# EAGLE design rc2014_z80plus (EAGLE 8.1.0)
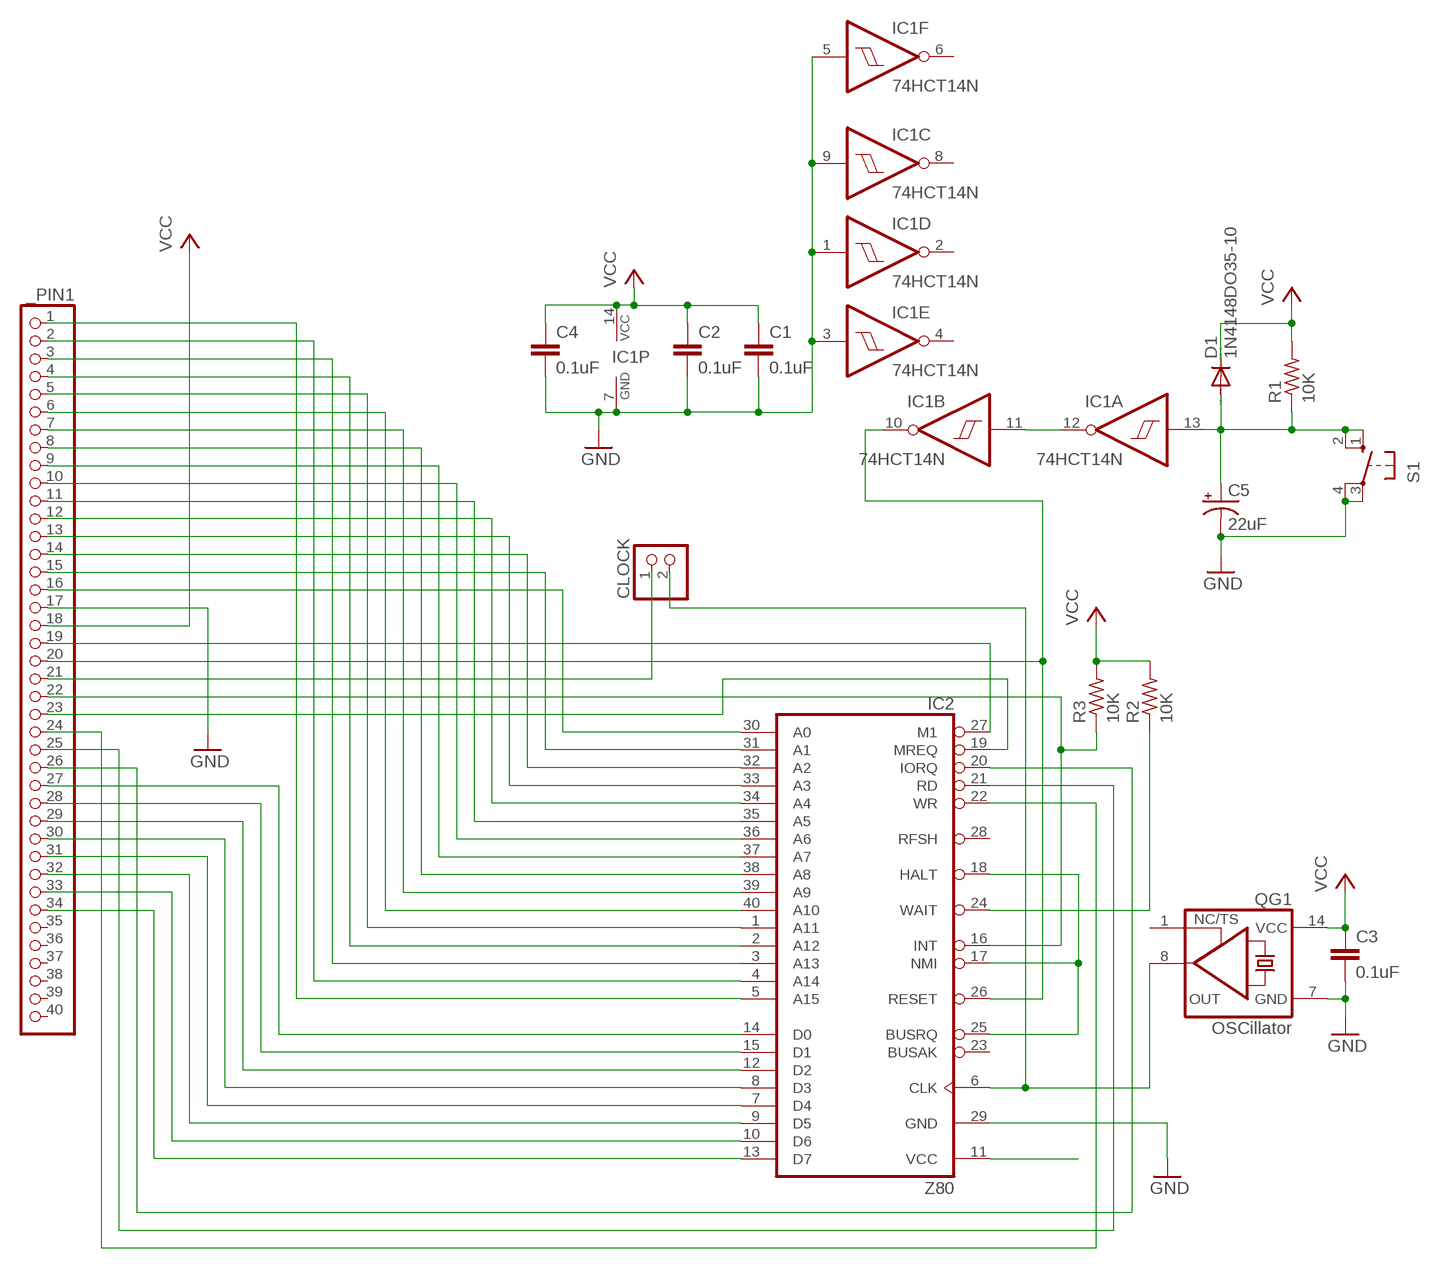
[diagram p0: schematic, sheet 1]

## Parts
_PIN1  PINHD-1X40  [1X40]
C1  0.1uF  C-EU050-024X044  [C050-024X044]
C2  0.1uF  C-EU050-024X044  [C050-024X044]
C3  0.1uF  C-EU050-024X044  [C050-024X044]
C4  0.1uF  C-EU050-024X044  [C050-024X044]
C5  22uF  CPOL-USTAP5-80  [TAP5-80]
CLOCK  PINHD-1X2  [1X02]
D1  1N4148DO35-10  [DO35-10]
IC1  74HCT14N  [DIL14]
IC2  Z80  Z80CPU  [DIL40]
QG1  OSCillator  XO-14  [DIL14S]
R1  10K  R-US_0207/10  [0207/10]
R2  10K  R-US_0207/10  [0207/10]
R3  10K  R-US_0207/10  [0207/10]
S1  10-XX  [B3F-10XX]

## Nets
/INT: _PIN1.22 IC2.16(INT) R3.1
/IORQ: _PIN1.26 IC2.20(IORQ)
/M1: _PIN1.19 IC2.27(M1)
/MREQ: _PIN1.23 IC2.19(MREQ)
/RD: _PIN1.25 IC2.21(RD)
/RST: _PIN1.20 IC1.10(B:O) IC2.26(RESET)
/WAIT: IC2.24(WAIT) R2.1
/WR: _PIN1.24 IC2.22(WR)
A0: _PIN1.16 IC2.30(A0)
A1: _PIN1.15 IC2.31(A1)
A2: _PIN1.14 IC2.32(A2)
A3: _PIN1.13 IC2.33(A3)
A4: _PIN1.12 IC2.34(A4)
A5: _PIN1.11 IC2.35(A5)
A6: _PIN1.10 IC2.36(A6)
A7: _PIN1.9 IC2.37(A7)
A8: _PIN1.8 IC2.38(A8)
A9: _PIN1.7 IC2.39(A9)
A10: _PIN1.6 IC2.40(A10)
A11: _PIN1.5 IC2.1(A11)
A12: _PIN1.4 IC2.2(A12)
A13: _PIN1.3 IC2.3(A13)
A14: _PIN1.2 IC2.4(A14)
A15: _PIN1.1 IC2.5(A15)
CLK: _PIN1.21 CLOCK.1
D0: _PIN1.27 IC2.14(D0)
D1: _PIN1.28 IC2.15(D1)
D2: _PIN1.29 IC2.12(D2)
D3: _PIN1.30 IC2.8(D3)
D4: _PIN1.31 IC2.7(D4)
D5: _PIN1.32 IC2.9(D5)
D6: _PIN1.33 IC2.10(D6)
D7: _PIN1.34 IC2.13(D7)
GND: _PIN1.17 C1.2 C2.2 C3.2 C4.2 C5.- IC1.1(D:I) IC1.3(E:I) IC1.5(F:I) IC1.7(P:GND) IC1.9(C:I) IC2.29(GND) QG1.7(GND) S1.3(P) S1.4(P1)
N$15: IC1.11(B:I) IC1.12(A:O)
OSC: CLOCK.2 IC2.6(CLK) QG1.8(OUT)
RESET: C5.+ D1.A IC1.13(A:I) R1.1 S1.1(S) S1.2(S1)
VCC: _PIN1.18 C1.1 C2.1 C3.1 C4.1 D1.C IC1.14(P:VCC) IC2.11(VCC) IC2.17(NMI) IC2.18(HALT) IC2.25(BUSRQ) QG1.14(VCC) R1.2 R2.2 R3.2
Unconnected: _PIN1.35 _PIN1.36 _PIN1.37 _PIN1.38 _PIN1.39 _PIN1.40 IC1.2(D:O) IC1.4(E:O) IC1.6(F:O) IC1.8(C:O) IC2.23(BUSAK) IC2.28(RFSH) QG1.1(TS)

## Library data of the parts
_PIN1 = pinhead:PINHD-1X40: PIN HEADER
C1-C4 = rcl:C-EU: CAPACITOR, European symbol
C5 = rcl:CPOL-US: POLARIZED CAPACITOR, American symbol
CLOCK = pinhead:PINHD-1X2: PIN HEADER
D1 = diode:1N4148: DIODE high speed (Philips)
IC1 = 74xx-eu:74*14: Hex schmitt trigger INVERTER
IC2 = zilog:Z80CPU: Z80 FAMILY DEVICE
QG1 = crystal:XO-: CRYSTAL; OC_FARNELL: unknown; OC_NEWARK: unknown
R1-R3 = rcl:R-US_: RESISTOR, American symbol
S1 = switch-omron:10-XX: OMRON SWITCH; MPN: B3F-1000; OC_FARNELL: 176432; OC_NEWARK: 36M3542

## Net classes
0 +5V: width 0.508 mm

## Board
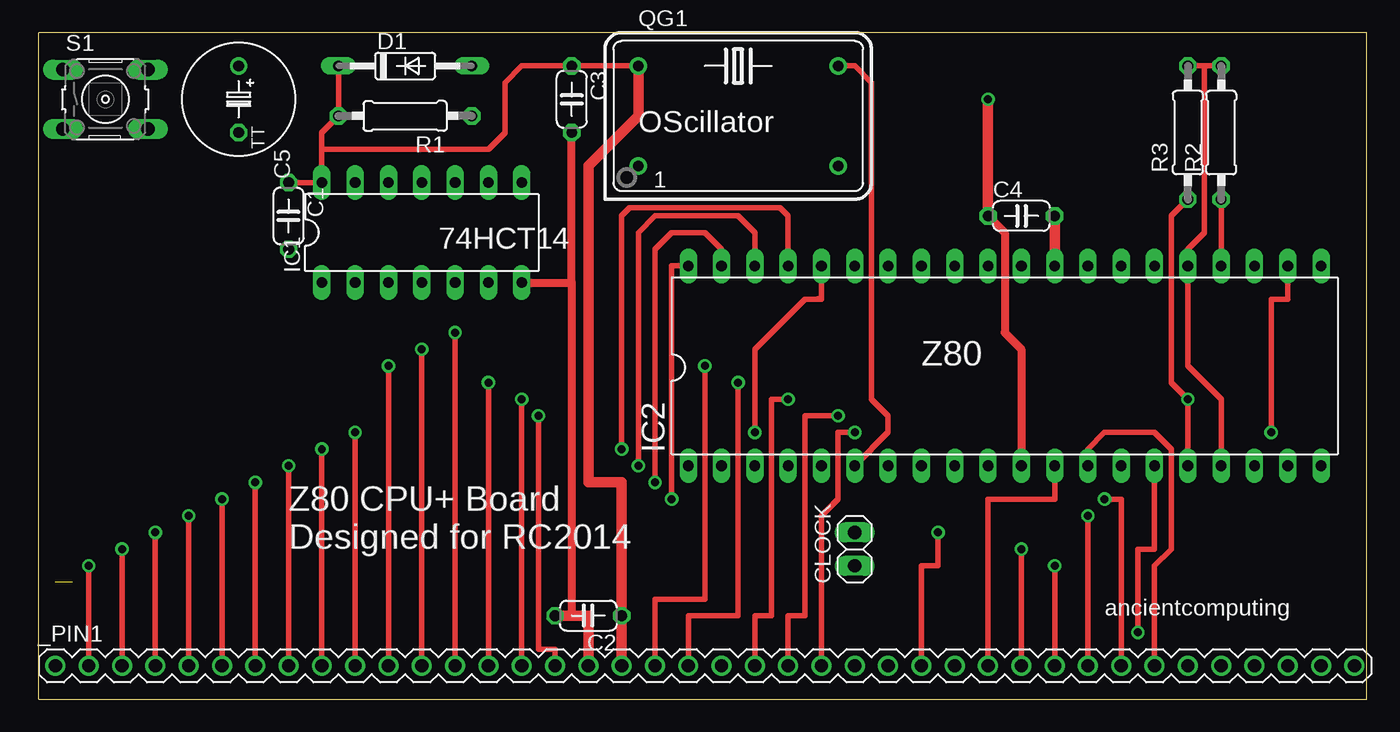
[diagram p1: board, top side]
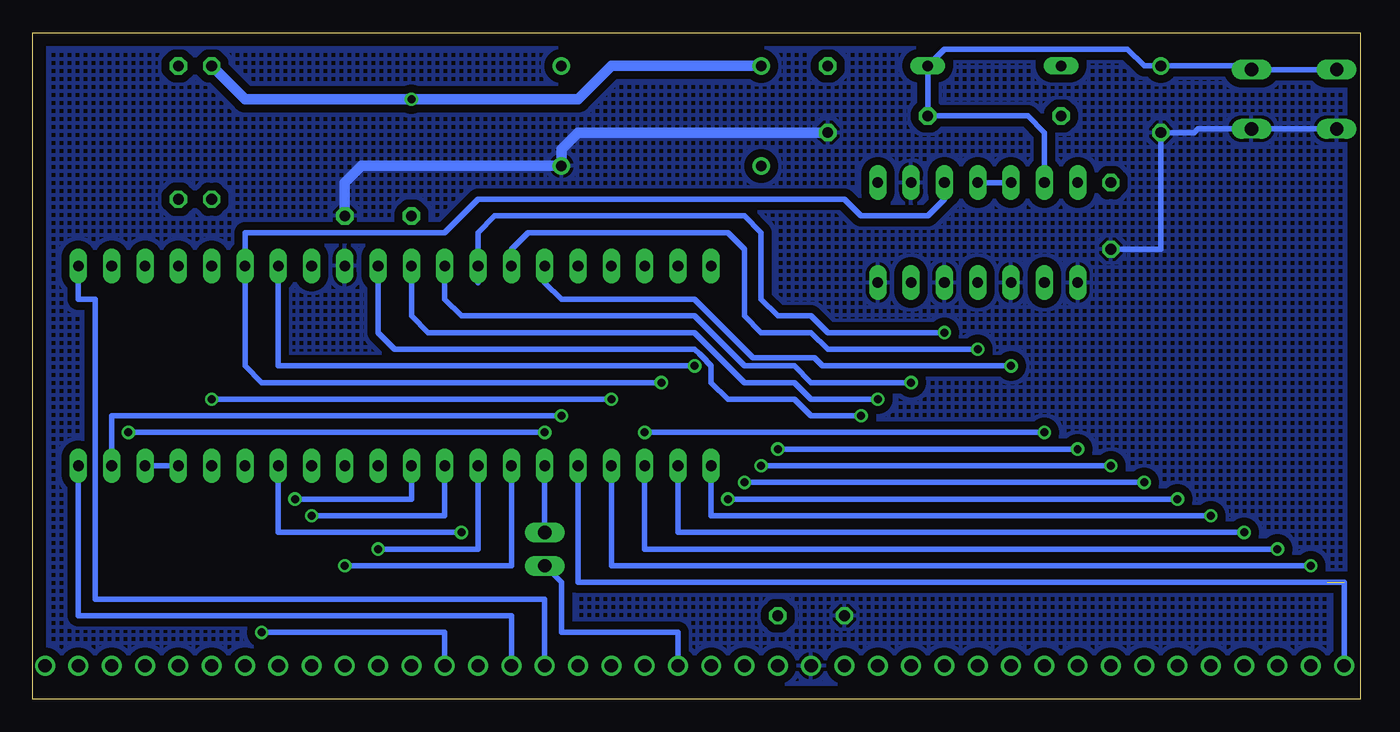
[diagram p2: board, bottom side, seen from below]

Size 101.27 x 50.79 mm. Coordinates in mm from the lower left corner, seen from the top.
Outline: 0,0 101.27,0 101.27,50.79 0,50.79 0,0
Copper layers (1*16): Top 0.035mm / dielectric 1.5mm / Bottom 0.035mm
Design rules "default *": minimum track width 20mil, minimum drill 24mil, track to track 8mil, track to pad 8mil, pad to pad 8mil, via to via 8mil, smd to smd 8mil, copper to edge 40mil, drill to drill 8mil, minimum pad ring 10mil, minimum via ring 8mil, stop-mask expansion 4mil, vias tented up to drill 0mil, thermal gap 10mil

### Footprints (pad centres in the part's own frame; a part is rotated, then mirrored left to right if it is on the bottom)
1X40 = drill 1.016: 1 -49.53,0; 2 -46.99,0; 3 -44.45,0; 4 -41.91,0; 5 -39.37,0; 6 -36.83,0; 7 -34.29,0; 8 -31.75,0; 9 -29.21,0; 10 -26.67,0; 11 -24.13,0; 12 -21.59,0; 13 -19.05,0; 14 -16.51,0; 15 -13.97,0; 16 -11.43,0; 17 -8.89,0; 18 -6.35,0; 19 -3.81,0; 20 -1.27,0; 21 1.27,0; 22 3.81,0; 23 6.35,0; 24 8.89,0; 25 11.43,0; 26 13.97,0; 27 16.51,0; 28 19.05,0; 29 21.59,0; 30 24.13,0; 31 26.67,0; 32 29.21,0; 33 31.75,0; 34 34.29,0; 35 36.83,0; 36 39.37,0; 37 41.91,0; 38 44.45,0; 39 46.99,0; 40 49.53,0
C050-024X044 = drill 0.813 octagon: 1 -2.54,0; 2 2.54,0
TAP5-80 = drill 0.813: + -2.54,0 | drill 0.813 octagon: - 2.54,0
1X02 = drill 1.016 long: 1 -1.27,0; 2 1.27,0
DO35-10 = drill 0.813 long: A 5.08,0; C -5.08,0
DIL14 = drill 0.813 long: 1 -7.62,-3.81; 2 -5.08,-3.81; 3 -2.54,-3.81; 4 0,-3.81; 5 2.54,-3.81; 6 5.08,-3.81; 7 7.62,-3.81; 8 7.62,3.81; 9 5.08,3.81; 10 2.54,3.81; 11 0,3.81; 12 -2.54,3.81; 13 -5.08,3.81; 14 -7.62,3.81
DIL40 = drill 0.813 long: 1 -24.13,-7.62; 2 -21.59,-7.62; 3 -19.05,-7.62; 4 -16.51,-7.62; 5 -13.97,-7.62; 6 -11.43,-7.62; 7 -8.89,-7.62; 8 -6.35,-7.62; 9 -3.81,-7.62; 10 -1.27,-7.62; 11 1.27,-7.62; 12 3.81,-7.62; 13 6.35,-7.62; 14 8.89,-7.62; 15 11.43,-7.62; 16 13.97,-7.62; 17 16.51,-7.62; 18 19.05,-7.62; 19 21.59,-7.62; 20 24.13,-7.62; 21 24.13,7.62; 22 21.59,7.62; 23 19.05,7.62; 24 16.51,7.62; 25 13.97,7.62; 26 11.43,7.62; 27 8.89,7.62; 28 6.35,7.62; 29 3.81,7.62; 30 1.27,7.62; 31 -1.27,7.62; 32 -3.81,7.62; 33 -6.35,7.62; 34 -8.89,7.62; 35 -11.43,7.62; 36 -13.97,7.62; 37 -16.51,7.62; 38 -19.05,7.62; 39 -21.59,7.62; 40 -24.13,7.62
DIL14S = drill 0.813: 1 -7.62,-3.81; 7 7.62,-3.81; 8 7.62,3.81; 14 -7.62,3.81
0207/10 = drill 0.813 octagon: 1 -5.08,0; 2 5.08,0
B3F-10XX = drill 1.016 long: 1 -3.251,2.261; 2 3.251,2.261; 3 -3.251,-2.261; 4 3.251,-2.261

### Placement (x,y rotation side)
_PIN1  50.8,2.54 0 top
C1  19.05,36.83 270 top
C2  41.91,6.35 180 top
C3  40.64,45.72 270 top
C4  74.93,36.83 0 top
C5  15.24,45.72 270 top
CLOCK  62.23,11.43 90 top
D1  27.94,48.26 0 top
IC1  29.21,35.56 0 top
IC2  73.66,25.4 0 top
QG1  53.34,44.45 0 top
R1  27.94,44.45 180 top
R2  90.17,43.18 90 top
R3  87.63,43.18 90 top
S1  5.08,45.72 0 top

### Tracks (layer width: path | path; a pad name or v marks a point on that pad's centre or on a via)
/INT  (via drill 0.61)
  Top 0.406: 54.61,5.08 _PIN1.22 54.61,6.35 55.88,6.35 55.88,22.86 v57.15,22.86 | IC2.16 v87.63,22.86 86.36,24.13 86.36,36.83 R3.1
  Bottom 0.406: v57.15,22.86 v87.63,22.86
/IORQ
  Bottom 0.406: IC2.20 97.79,6.35 64.77,6.35 _PIN1.26
/M1  (via drill 0.61)
  Top 0.406: _PIN1.19 46.99,7.62 50.8,7.62 v50.8,25.4
  Bottom 0.406: v50.8,25.4 82.55,25.4 IC2.27
/MREQ  (via drill 0.61)
  Top 0.406: _PIN1.23 57.15,6.35 58.42,6.35 58.42,21.59 v60.96,21.59
  Bottom 0.406: v60.96,21.59 95.25,21.59 IC2.19
/RD
  Bottom 0.406: _PIN1.25 62.23,7.62 96.52,7.62 96.52,30.48 97.79,30.48 IC2.21
/RST  (via drill 0.61)
  Top 0.406: _PIN1.20 49.53,6.35 53.34,6.35 v53.34,24.13
  Bottom 0.406: IC1.10 31.75,38.1 33.02,36.83 38.1,36.83 39.37,38.1 67.31,38.1 69.85,35.56 85.09,35.56 IC2.26 85.09,25.4 83.82,24.13 v53.34,24.13
/WAIT
  Top 0.406: IC2.24 R2.1
/WR  (via drill 0.61)
  Top 0.406: v93.98,20.32 93.98,30.48 95.25,30.48 IC2.22 | v62.23,20.32 60.96,20.32 60.96,15.24 59.69,13.97 _PIN1.24
  Bottom 0.406: v62.23,20.32 v93.98,20.32
A0  (via drill 0.61)
  Top 0.406: _PIN1.16 39.37,3.81 38.1,3.81 v38.1,21.59
  Bottom 0.406: v38.1,21.59 41.91,21.59 43.18,22.86 48.26,22.86 49.53,24.13 49.53,25.4 49.89,25.76 49.89,25.78 50.42,26.31 50.44,26.31 50.8,26.67 73.66,26.67 74.93,27.94 IC2.30
A1  (via drill 0.61)
  Top 0.406: _PIN1.15 v36.83,22.86
  Bottom 0.406: v36.83,22.86 41.91,22.86 43.18,24.13 46.99,24.13 50.8,27.94 71.12,27.94 72.39,29.21 IC2.31
A2  (via drill 0.61)
  Top 0.406: _PIN1.14 v34.29,24.13
  Bottom 0.406: IC2.32 69.85,30.48 68.58,29.21 50.8,29.21 46.99,25.4 43.18,25.4 41.91,24.13 v34.29,24.13
A3  (via drill 0.61)
  Top 0.406: _PIN1.13 v31.75,27.94
  Bottom 0.406: v31.75,27.94 40.64,27.94 41.91,29.21 44.45,29.21 45.72,30.48 45.72,35.56 46.99,36.83 66.04,36.83 67.31,35.56 IC2.33 67.31,31.75
A4  (via drill 0.61)
  Top 0.406: _PIN1.12 v29.21,26.67
  Bottom 0.406: v29.21,26.67 40.64,26.67 41.91,27.94 45.72,27.94 46.99,29.21 46.99,34.29 48.26,35.56 63.5,35.56 64.77,34.29 IC2.34
A5  (via drill 0.61)
  Top 0.406: _PIN1.11 v26.67,25.4
  Bottom 0.406: v26.67,25.4 41.05,25.4 41.66,26.01 46.33,26.01 50.8,30.48 60.96,30.48 62.23,31.75 IC2.35
A6  (via drill 0.61)
  Top 0.406: _PIN1.10 v24.13,20.32 | 59.44,30.48 58.42,30.48 54.61,26.67 v54.61,20.32 | 59.44,30.48 59.44,30.5 | 59.44,30.48 59.69,30.48 IC2.36
  Bottom 0.406: v24.13,20.32 v54.61,20.32
A7  (via drill 0.61)
  Top 0.406: _PIN1.9 v21.59,19.05 | 57.15,34.29 IC2.37 57.15,36.83 56.54,37.44 45.06,37.44 44.45,36.83 v44.45,19.05
  Bottom 0.406: v21.59,19.05 v44.45,19.05
A8  (via drill 0.61)
  Top 0.406: _PIN1.8 v19.05,17.78 | v45.72,17.78 45.72,35.56 46.99,36.83 53.34,36.83 54.61,35.56 IC2.38
  Bottom 0.406: v19.05,17.78 v45.72,17.78
A9  (via drill 0.61)
  Top 0.406: _PIN1.7 v16.51,16.51 | v46.99,16.51 46.99,34.29 48.26,35.56 50.8,35.56 52.07,34.29 IC2.39
  Bottom 0.406: v16.51,16.51 v46.99,16.51
A10  (via drill 0.61)
  Top 0.406: _PIN1.6 v13.97,15.24 | v48.26,15.24 48.26,33.02 IC2.40
  Bottom 0.406: v13.97,15.24 v48.26,15.24
A11  (via drill 0.61)
  Top 0.406: v11.43,13.97 _PIN1.5
  Bottom 0.406: v11.43,13.97 49.53,13.97 IC2.1
A12  (via drill 0.61)
  Top 0.406: v8.89,12.7 _PIN1.4
  Bottom 0.406: v8.89,12.7 52.07,12.7 IC2.2
A13  (via drill 0.61)
  Top 0.406: v6.35,11.43 _PIN1.3
  Bottom 0.406: v6.35,11.43 54.61,11.43 IC2.3
A14  (via drill 0.61)
  Top 0.406: v3.81,10.16 _PIN1.2
  Bottom 0.406: v3.81,10.16 57.15,10.16 IC2.4
A15  (2 unrouted)
  Bottom 0.406: IC2.5 59.69,8.89 1.27,8.89 _PIN1.1
CLK
  Bottom 0.406: _PIN1.21 52.07,5.08 60.96,5.08 60.96,8.89 CLOCK.1
D0  (via drill 0.61)
  Top 0.406: _PIN1.27 67.31,10.16 68.58,10.16 v68.58,12.7
  Bottom 0.406: v68.58,12.7 82.55,12.7 IC2.14
D1  (via drill 0.61)
  Top 0.406: v83.82,5.08 83.82,11.43 85.09,11.43 IC2.15
  Bottom 0.406: _PIN1.28 69.85,5.08 v83.82,5.08
D2
  Top 0.406: IC2.12 77.47,15.24 72.39,15.24 _PIN1.29
D3  (via drill 0.61)
  Top 0.406: _PIN1.30 v74.93,11.43
  Bottom 0.406: v74.93,11.43 67.31,11.43 IC2.8
D4  (via drill 0.61)
  Top 0.406: _PIN1.31 v77.47,10.16
  Bottom 0.406: v77.47,10.16 64.77,10.16 IC2.7
D5  (via drill 0.61)
  Top 0.406: _PIN1.32 v80.01,13.97
  Bottom 0.406: v80.01,13.97 69.85,13.97 IC2.9
D6  (via drill 0.61)
  Top 0.406: 82.55,12.7 _PIN1.33 82.55,15.24 v81.28,15.24
  Bottom 0.406: v81.28,15.24 72.39,15.24 IC2.10
D7
  Top 0.406: _PIN1.34 85.09,10.16 86.36,11.43 86.36,19.05 85.09,20.32 81.28,20.32 80.01,19.05 IC2.13
GND
  Top 0.61: 40.64,31.75 40.64,6.35 | 40.64,31.75 C3.2 | IC1.7 40.64,31.75
  Top 0.813: C2.2 40.64,6.35 41.91,6.35 _PIN1.17 | C4.2 IC2.29
  Bottom 0.406: S1.3 S1.4 12.42,43.46 12.7,43.18 C5.- 15.24,34.29 C1.2
  Bottom 0.813: C3.2 59.69,43.18 60.96,41.91 QG1.7 76.2,40.64 77.47,39.37 C4.2
  pour Bottom (isolate 0.61, hatched): 0,50.8 0,0 101.6,0 101.6,50.8
N$15
  Bottom 0.406: IC1.12 IC1.11
OSC
  Top 0.406: IC2.6 64.77,20.32 64.77,21.59 63.5,22.86 63.5,46.99 62.23,48.26 QG1.8
  Bottom 0.406: IC2.6 CLOCK.2
RESET
  Bottom 0.406: S1.1 S1.2 8.61,48.26 C5.+ 16.51,48.26 17.78,49.53 31.75,49.53 D1.A R1.1 25.4,44.45 24.13,43.18 IC1.13
VCC  (via drill 0.61)
  Top 0.406: IC2.17 90.17,22.86 87.63,25.4 IC2.25 87.63,34.29 88.9,35.56 88.9,48.26 | 88.9,48.26 R3.2 | R2.2 88.9,48.26 | D1.C R1.2 21.59,43.18 21.59,41.91 | 21.59,41.91 IC1.14 C1.1 | QG1.14 C3.1 36.83,48.26 35.56,46.99 35.56,43.18 34.29,41.91 21.59,41.91
  Top 0.61: C4.1 73.66,35.56 73.66,27.94 74.93,26.67 IC2.11
  Top 0.813: _PIN1.18 C2.1 44.45,16.51 41.91,16.51 41.91,40.64 45.72,44.45 QG1.14 | v72.39,45.72 C4.1
  Bottom 0.406: IC2.17 IC2.18
  Bottom 0.813: QG1.14 57.15,48.26 59.69,45.72 v72.39,45.72 85.09,45.72 R3.2

### Text on the board
tNames: OScillator | 74HCT14 | Z80 | Z80 CPU+ Board / Designed for RC2014 | ancientcomputing